# Altium schematic sheet UnitC.SchDoc
size 297 x 209 mm
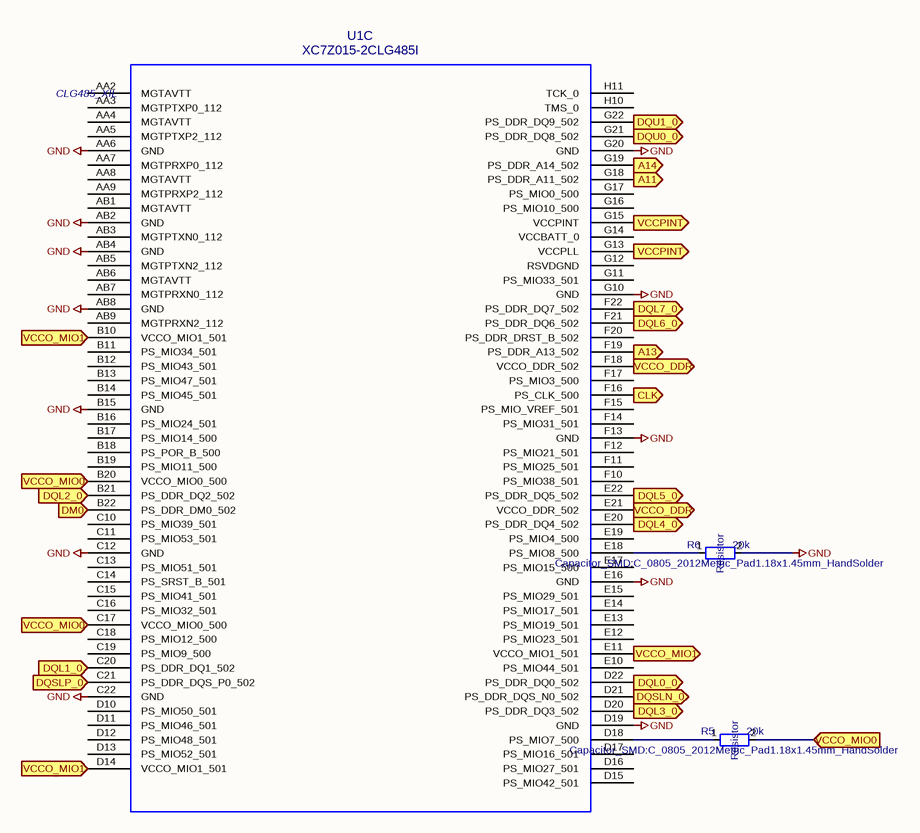
[diagram p0: UnitC.SchDoc]

## Parts
R5  Description: Resistor  Footprint: Capacitor_SMD:C_0805_2012Metric_Pad1.18x1.45mm_HandSolder  [C_0805_2012Metric_Pad1.18x1.45mm_HandSolder]  (hidden comment: 20k)
R6  Description: Resistor  Footprint: Capacitor_SMD:C_0805_2012Metric_Pad1.18x1.45mm_HandSolder  [C_0805_2012Metric_Pad1.18x1.45mm_HandSolder]  (hidden comment: 20k)
U1  XC7Z015-2CLG485I  [CLG485_XIL]  (part C of 5)

## Ports
A11 (in), A13 (in), A14 (in), CLK (in), DM0 (in), DQL0_0 (in), DQL1_0 (in), DQL2_0 (in), DQL3_0 (in), DQL4_0 (in), DQL5_0 (in), DQL6_0 (in), DQL7_0 (in), DQSLN_0 (in), DQSLP_0 (in), DQU0_0 (in), DQU1_0 (in), VCCO_DDR (in), VCCO_MIO0 (in), VCCO_MIO1 (in), VCCPINT (in)

## Nets
GND: R6.2 U1.AA6(GND) U1.AB2(GND) U1.AB4(GND) U1.AB8(GND) U1.B15(GND) U1.C12(GND) U1.C22(GND) U1.D19(GND) U1.E16(GND) U1.F13(GND) U1.G10(GND) U1.G20(GND)
A11: U1.G18(PS_DDR_A11_502) ; port A11
A13: U1.F19(PS_DDR_A13_502) ; port A13
A14: U1.G19(PS_DDR_A14_502) ; port A14
CLK: U1.F16(PS_CLK_500) ; port CLK
DM0: U1.B22(PS_DDR_DM0_502) ; port DM0
DQL0_0: U1.D22(PS_DDR_DQ0_502) ; port DQL0_0
DQL1_0: U1.C20(PS_DDR_DQ1_502) ; port DQL1_0
DQL2_0: U1.B21(PS_DDR_DQ2_502) ; port DQL2_0
DQL3_0: U1.D20(PS_DDR_DQ3_502) ; port DQL3_0
DQL4_0: U1.E20(PS_DDR_DQ4_502) ; port DQL4_0
DQL5_0: U1.E22(PS_DDR_DQ5_502) ; port DQL5_0
DQL6_0: U1.F21(PS_DDR_DQ6_502) ; port DQL6_0
DQL7_0: U1.F22(PS_DDR_DQ7_502) ; port DQL7_0
DQSLN_0: U1.D21(PS_DDR_DQS_N0_502) ; port DQSLN_0
DQSLP_0: U1.C21(PS_DDR_DQS_P0_502) ; port DQSLP_0
DQU0_0: U1.G21(PS_DDR_DQ8_502) ; port DQU0_0
DQU1_0: U1.G22(PS_DDR_DQ9_502) ; port DQU1_0
VCCO_DDR: U1.E21(VCCO_DDR_502) U1.F18(VCCO_DDR_502) ; port VCCO_DDR
VCCO_MIO0: R5.2 U1.B20(VCCO_MIO0_500) U1.C17(VCCO_MIO0_500) ; port VCCO_MIO0
VCCO_MIO1: U1.B10(VCCO_MIO1_501) U1.D14(VCCO_MIO1_501) U1.E11(VCCO_MIO1_501) ; port VCCO_MIO1
VCCPINT: U1.G13(VCCPLL) U1.G15(VCCPINT) ; port VCCPINT
NetR5_1: R5.1 U1.D18(PS_MIO7_500)
NetR6_1: R6.1 U1.E18(PS_MIO8_500)

Not connected (* = marked no-connect by the designer): U1 AA2(MGTAVTT) AA3(MGTPTXP0_112) AA4(MGTAVTT) AA5(MGTPTXP2_112) AA7(MGTPRXP0_112) AA8(MGTAVTT) AA9(MGTPRXP2_112) AB1(MGTAVTT) AB3(MGTPTXN0_112) AB5(MGTPTXN2_112) AB6(MGTAVTT) AB7(MGTPRXN0_112) AB9(MGTPRXN2_112) B11(PS_MIO34_501) B12(PS_MIO43_501) B13(PS_MIO47_501) B14(PS_MIO45_501) B16(PS_MIO24_501) B17(PS_MIO14_500) B18(PS_POR_B_500) B19(PS_MIO11_500) C10(PS_MIO39_501) C11(PS_MIO53_501) C13(PS_MIO51_501) C14(PS_SRST_B_501) C15(PS_MIO41_501) C16(PS_MIO32_501) C18(PS_MIO12_500) C19(PS_MIO9_500) D10(PS_MIO50_501) D11(PS_MIO46_501) D12(PS_MIO48_501) D13(PS_MIO52_501) D15(PS_MIO42_501) D16(PS_MIO27_501) D17(PS_MIO16_501) E10(PS_MIO44_501) E12(PS_MIO23_501) E13(PS_MIO19_501) E14(PS_MIO17_501) E15(PS_MIO29_501) E17(PS_MIO15_500) E19(PS_MIO4_500) F10(PS_MIO38_501) F11(PS_MIO25_501) F12(PS_MIO21_501) F14(PS_MIO31_501) F15(PS_MIO_VREF_501) F17(PS_MIO3_500) F20(PS_DDR_DRST_B_502) G11(PS_MIO33_501) G12(RSVDGND) G14(VCCBATT_0) G16(PS_MIO10_500) G17(PS_MIO0_500) H10(TMS_0) H11(TCK_0)

## Notes on the sheet
- 1
- 2
- 3
- 4
- 5
- 6
- A
- B
- C
- D
- Title:
- File: UnitC.kicad_sch
- Sheet: /
- KiCad E.D.A.  kicad (5.1.4)-1
- Size: A4
- Date:
- Rev:
- Id: 1/1

## Library data of the parts
R5 R6 = R: Value: 20k
U1 = XC7Z015-2CLG485I: Value: XC7Z015-2CLG485I